# EAGLE design Alimentatore (EAGLE 4.14)
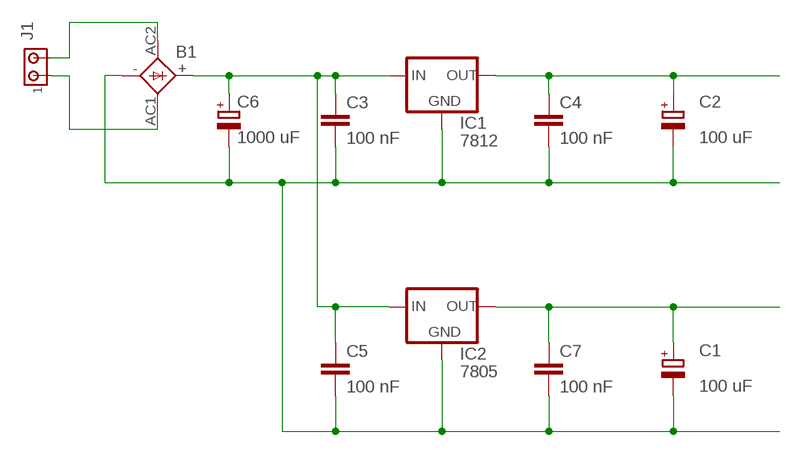
[diagram p0: schematic, sheet 1]

## Parts
B1  FBU4  [FBU4]
C1  100 uF  CPOL-EUE3.5-8  [E3,5-8]
C2  100 uF  CPOL-EUE3.5-8  [E3,5-8]
C3  100 nF  C-EU050-030X075  [C050-030X075]
C4  100 nF  C-EU050-030X075  [C050-030X075]
C5  100 nF  C-EU050-030X075  [C050-030X075]
C6  1000 uF  CPOL-EUE5-10.5  [E5-10,5]
C7  100 nF  C-EU050-030X075  [C050-030X075]
IC1  7812  78XXS  [78XXS]
IC2  7805  78XXS  [78XXS]
J1  MTA02-156  [1X2MTA]

## Nets
N$1: B1.AC2(AC1) J1.2
N$2: B1.AC1(AC2) J1.1
N$3: B1.+ C3.1 C5.1 C6.+ IC1.IN IC2.IN
N$4: C2.+ C4.1 IC1.OUT
N$9: C1.+ C7.1 IC2.OUT
N$10: B1.- C1.- C2.- C3.2 C4.2 C5.2 C6.- C7.2 IC1.GND IC2.GND

## Library data of the parts
B1 = rectifier:FBU4: FAGOR RECTIFIER grid 3 x 5 mm
C1 C2 C6 = rcl:CPOL-EU: POLARIZED CAPACITOR, European symbol
C3-C5 C7 = rcl:C-EU: CAPACITOR, European symbol
IC1 IC2 = v-reg:78XXS: VOLTAGE REGULATOR
J1 = con-amp:MTA02-156: AMP connector

## Board
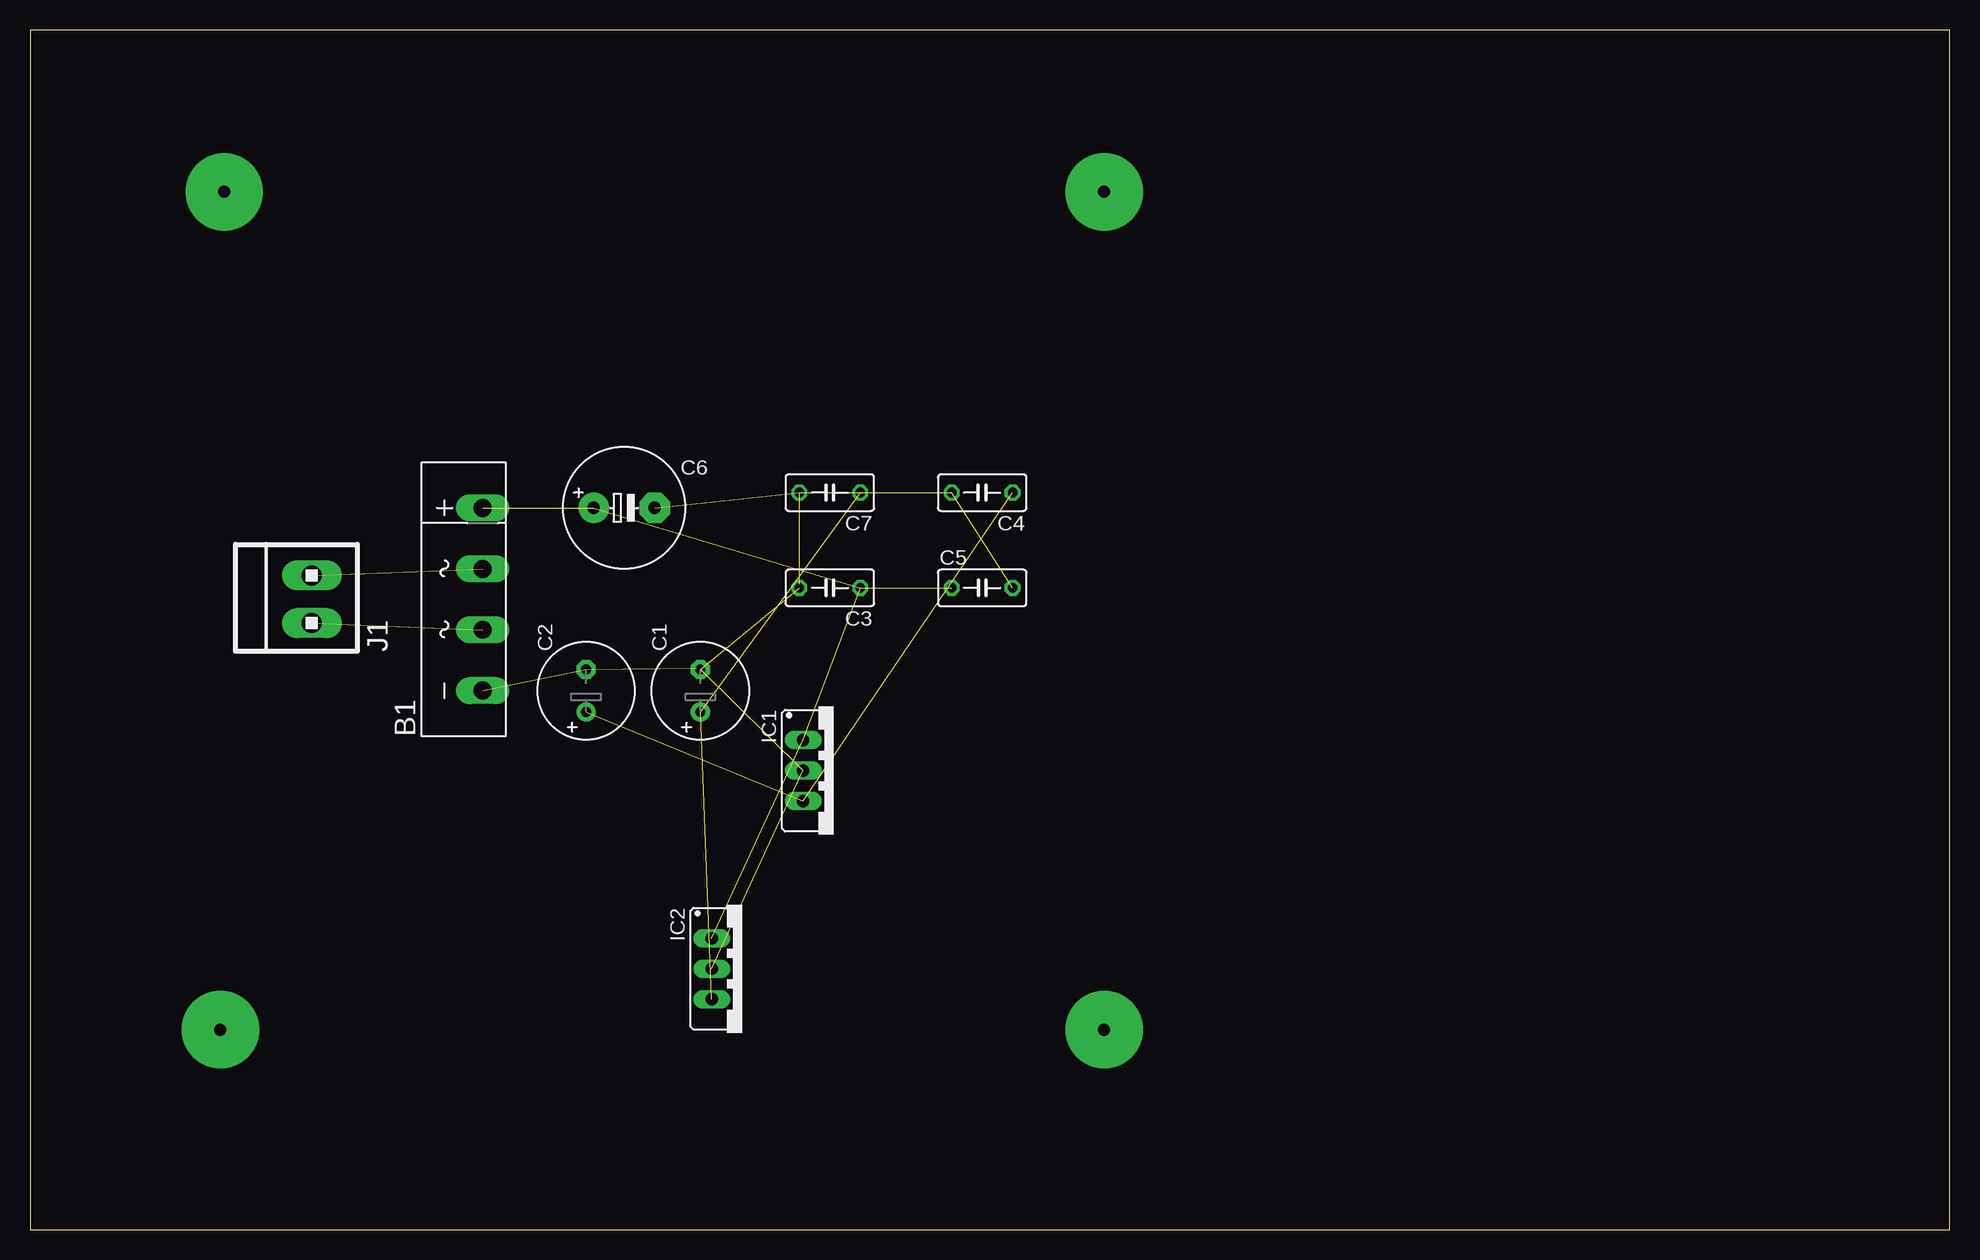
[diagram p1: board, top side]
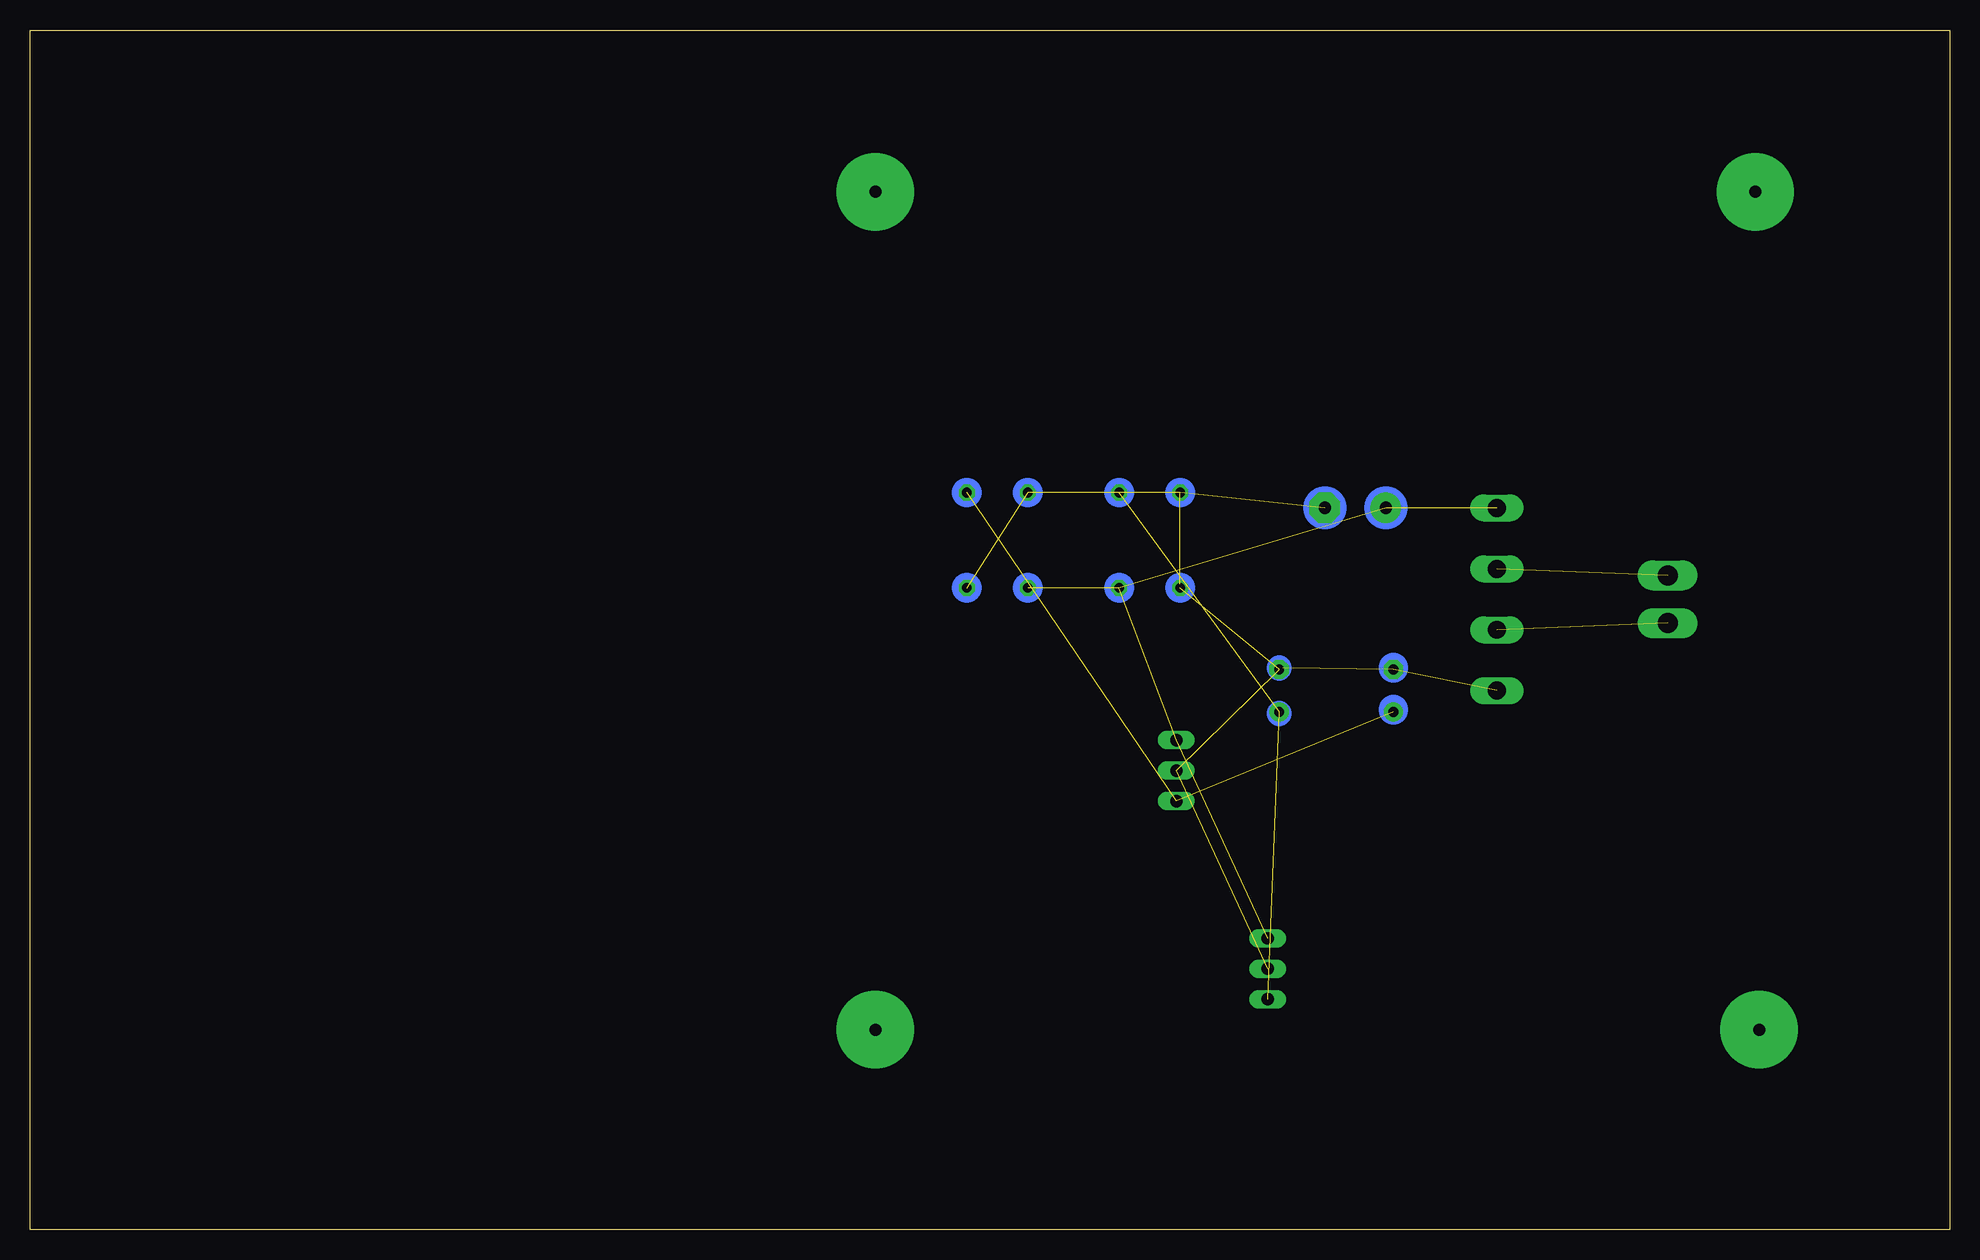
[diagram p2: board, bottom side, seen from below]

Size 160 x 100 mm. Coordinates in mm from the lower left corner, seen from the top.
Outline: 0,0 160,0 160,100 0,100 0,0
Copper layers (1*16): Top 0.035mm / dielectric 1.5mm / Bottom 0.035mm
Design rules "default": minimum track width 40mil, minimum drill 24mil, track to track 8mil, track to pad 8mil, pad to pad 8mil, via to via 8mil, smd to smd 8mil, copper to edge 40mil, drill to drill 8mil, minimum pad ring 10mil, minimum via ring 8mil, stop-mask expansion 4mil, vias tented up to drill 0mil, thermal gap 10mil

### Footprints (pad centres in the part's own frame; a part is rotated, then mirrored left to right if it is on the bottom)
FBU4 = drill 1.499 long: + 7.62,-1.54; - -7.62,-1.54; AC1 2.54,-1.54; AC2 -2.54,-1.54
E3,5-8 = drill 0.813 pad 1.6 round: + -1.778,0 | drill 0.813 pad 1.6 octagon: - 1.778,0
C050-030X075 = drill 0.813 octagon: 1 -2.54,0; 2 2.54,0
E5-10,5 = drill 1.016 pad 2.54 round: + -2.54,0 | drill 1.016 pad 2.54 octagon: - 2.54,0
78XXS = drill 1.016 long: GND 0,-2.54; IN -2.54,-2.54; OUT 2.54,-2.54
1X2MTA = drill 1.676 long: 1 1.981,0; 2 -1.981,0

### Placement (x,y rotation side)
B1  36.19,52.54 90 top
C1  55.88,44.92 90 top
C2  46.35,44.92 90 top
C3  66.67,53.49 180 top
C4  79.37,61.43 180 top
C5  79.37,53.49 0 top
C6  49.53,60.16 0 top
C7  66.67,61.43 180 top
IC1  66.99,38.25 270 top
IC2  59.37,21.74 270 top
J1  23.49,52.54 90 top

### Tracks (layer width: path | path; a pad name or v marks a point on that pad's centre or on a via)
N$1  (1 unrouted)
N$2  (1 unrouted)
N$3  (5 unrouted)
N$4  (2 unrouted)
N$5  (via drill 1 pad 6.45)
  other vias: 16.19,86.51
N$6  (via drill 1 pad 6.45)
  other vias: 15.87,16.66
N$7  (via drill 1 pad 6.45)
  other vias: 89.53,16.66
N$8  (via drill 1 pad 6.45)
  other vias: 89.53,86.51
N$9  (2 unrouted)
N$10  (9 unrouted)
  Bottom 1.016: C1.- 55.56,46.82 | C3.2 64.13,53.81 | C2.- 46.35,46.82
(copper drawn outside any net)
  shapes: Bottom circle x14